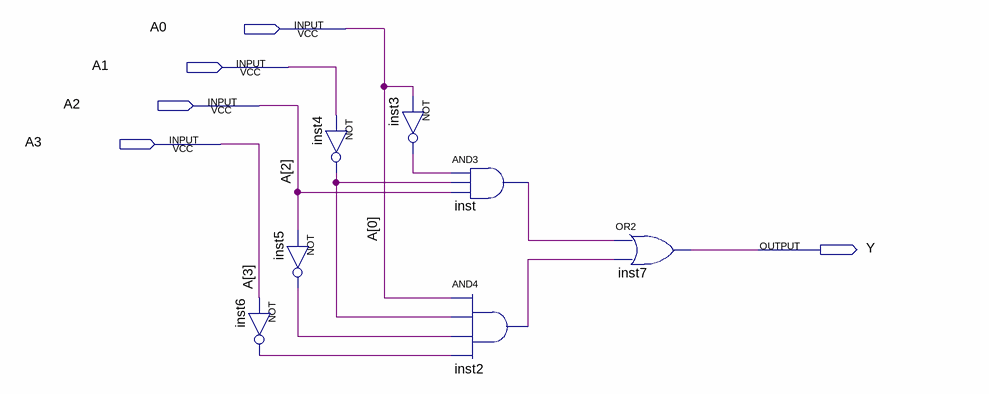
[diagram p0: schematic sheet]
// Quartus schematic Segment0.bdf as structural Verilog: 7 symbols, 5 pins
module Segment0 (
  input  A0,
  input  A1,
  input  A2,
  input  A3,
  output Y
);

  wire inst2_out, inst3_out, inst4_out, inst5_out, inst6_out, inst_out;

  not inst6 (inst6_out, A3);
  not inst4 (inst4_out, A1);
  not inst5 (inst5_out, A2);
  not inst3 (inst3_out, A0);
  and inst (inst_out, inst3_out, inst4_out, A2);
  and inst2 (inst2_out, A0, inst4_out, inst5_out, inst6_out);
  or inst7 (Y, inst_out, inst2_out);
endmodule
